# Altium schematic sheet TOP.SchDoc
size A3; SheetNumber: 1; SheetTotal: 3
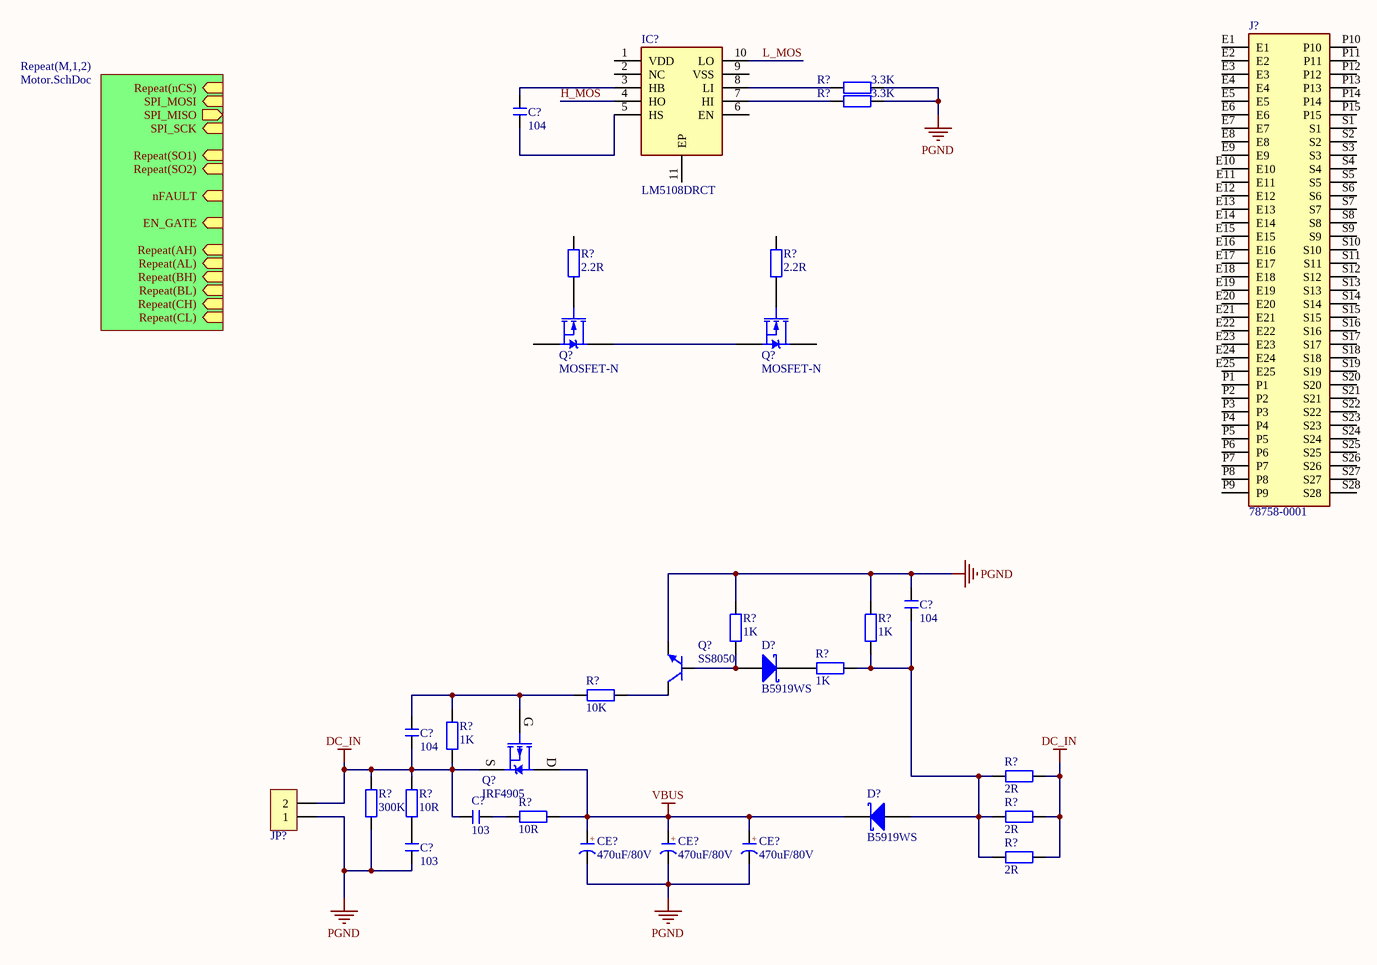
[diagram p0: TOP.SchDoc]

## Parts
(Parts that share a designator on the sheet are numbered #1, #2 ... from top to bottom, then left to right.)
C?#1  104  [C 0603_L]
C?#2  104  [C 0805_L]
C?#3  104  [C 0805_L]
C?#4  103  [C 0805_L]
C?#5  103  [C 0805_L]
CE?#1  470uF/80V  [CAP 1.5*4*8]
CE?#2  470uF/80V  [CAP 1.5*4*8]
CE?#3  470uF/80V  [CAP 1.5*4*8]
D?#1  B5919WS  [SOD-323]
D?#2  B5919WS  [SOD-323]
IC?  LM5108DRCT  [SON50P300X300X100-11N-D]
J?  78758-0001  [78758-0001]
JP?  HDR-1X2  [XH2.54-WI-2P]  (value not drawn)
Q?#1  MOSFET-N  [TO263-3B]
Q?#2  MOSFET-N  [TO263-3B]
Q?#3  SS8050  [SOT23-3N]
Q?#4  IRF4905  [TO220A]
R?#1  3.3K  [R 0603_L]
R?#2  3.3K  [R 0603_L]
R?#3  2.2R  [R 0603_L]
R?#4  2.2R  [R 0603_L]
R?#5  1K  [R 0805_L]
R?#6  1K  [R 0805_L]
R?#7  1K  [R 0805_L]
R?#8  10K  [R 0805_L]
R?#9  1K  [R 0805_L]
R?#10  300K  [R 0805_L]
R?#11  10R  [R 0805_L]
R?#12  2R  [RX10-18*15*5]
R?#13  10R  [R 0805_L]
R?#14  2R  [RX10-18*15*5]
R?#15  2R  [RX10-18*15*5]

## Sub-sheets
Repeat(M,1,2) = Motor.SchDoc: Repeat(nCS) (in), SPI_MOSI (in), SPI_MISO (out), SPI_SCK (in), Repeat(SO1) (in), Repeat(SO2) (in), nFAULT (in), Repeat(CH) (in), Repeat(CL) (in), Repeat(AH) (in), Repeat(AL) (in), Repeat(BH) (in), Repeat(BL) (in), EN_GATE (in)

## Nets
DC_IN: C?#3.1 C?#4.2 JP?.2 Q?#4.3(S) R?#9.1 R?#10.1 R?#11.1 R?#12.1 R?#14.1 R?#15.1
PGND: C?#2.1 C?#5.2 CE?#1.2(K) CE?#2.2(K) CE?#3.2(K) JP?.1 Q?#3.2(E) R?#1.2 R?#2.2 R?#5.1 R?#6.2 R?#10.2
VBUS: CE?#1.1(A) CE?#2.1(A) CE?#3.1(A) D?#2.2(K) Q?#4.2(D) R?#13.1
H_MOS: IC?.4(HO)
L_MOS: IC?.10(LO)
NetC?#1_1: C?#1.1 IC?.5(HS)
NetC?#1_2: C?#1.2 IC?.3(HB)
NetC?#2_2: C?#2.2 D?#2.1(A) R?#6.1 R?#7.2 R?#12.2 R?#14.2 R?#15.2
NetC?#3_2: C?#3.2 Q?#4.1(G) R?#8.1 R?#9.2
NetC?#4_1: C?#4.1 R?#13.2
NetC?#5_1: C?#5.1 R?#11.2
NetD?#1_1: D?#1.1(A) Q?#3.1(B) R?#5.2
NetD?#1_2: D?#1.2(K) R?#7.1
NetIC?_7: IC?.7(HI) R?#2.1
NetIC?_8: IC?.8(LI) R?#1.1
NetQ?#1_1: Q?#1.1(G) R?#3.2
NetQ?#1_2: Q?#1.2(D) Q?#2.3(S)
NetQ?#2_1: Q?#2.1(G) R?#4.2
NetQ?#3_3: Q?#3.3(C) R?#8.2

Not connected (* = marked no-connect by the designer): IC? 1(VDD) 2(NC) 6(EN) 9(VSS) 11(EP); J? E1 E2 E3 E4 E5 E6 E7 E8 E9 E10 E11 E12 E13 E14 E15 E16 E17 E18 E19 E20 E21 E22 E23 E24 E25 P1 P2 P3 P4 P5 P6 P7 P8 P9 P10 P11 P12 P13 P14 P15 S1 S2 S3 S4 S5 S6 S7 S8 S9 S10 S11 S12 S13 S14 S15 S16 S17 S18 S19 S20 S21 S22 S23 S24 S25 S26 S27 S28; Q?#1 3(S); Q?#2 2(D); R?#3 1; R?#4 1

## Notes on the sheet
- (in symbol CE) +

## Library data of the parts
C?#1-C?#5 = C: 贴片电容; BOM名称: 无极性贴片电容; 淘宝ID: 封装库来自淘宝 ID：黄晶宝石; 联系售后，技术支持: https://shop463601444.taobao.com; 唯一出售店铺网址: https://shop463601444.taobao.com
CE?#1-CE?#3 = CE: 直插电解电容; 淘宝ID: 封装库来自淘宝 ID：黄晶宝石; BOM名称: 直插电解电容; 联系售后: https://shop463601444.taobao.com
D?#1 D?#2 = 1N5819: 肖特基二极管; 淘宝ID: 封装库来自淘宝 ID：黄晶宝石; 属性: 40V/2A; BOM名称: 肖特基二极管; 欢迎光临: https://shop463601444.taobao.com
IC? = LM5108DRCT: Integrated Circuit; Manufacturer_Name: Texas Instruments; Datasheet Link: http://www.ti.com/lit/gpn/LM5108; Height: 1mm; Manufacturer_Part_Number: LM5108DRCT; Mouser Part Number: 595-LM5108DRCT; Mouser Price/Stock: https://www.mouser.co.uk/ProductDetail/Texas-Instruments/LM5108DRCT?qs=T3oQrply3y%2FzIxTRQrXrXQ%3D%3D; Arrow Part Number: LM5108DRCT; Arrow Price/Stock: https://www.arrow.com/en/products/lm5108drct/texas-instruments?region=nac
J? = 78758-0001: Connector; Manufacturer_Name: Molex; Manufacturer_Part_Number: 78758-0001; Mouser Part Number: 538-78758-0001; Mouser Price/Stock: https://www.mouser.co.uk/ProductDetail/Molex/78758-0001?qs=wOSGPAwRNAFEK7d2ROR5rw%3D%3D
JP? = Header 2: 2P接插件; 版权归属: 封装库来自淘宝 ID：黄晶宝石; BOM名称: 2P接插件; 联系售后: https://shop463601444.taobao.com
Q?#1 Q?#2 = MOSFET-N: N-Channel MOSFET; PackageDocument: 1995/1996; Published: 8-Jun-2000; LatestRevisionDate: 17-Jul-2002; LatestRevisionNote: Re-released for DXP Platform.; PackageReference: E3; Publisher: Altium Limited
Q?#3 = 8050-SMD: 高频放大-NPN型; 版权归属: 封装库来自淘宝 ID：黄晶宝石; 属性: 40V 1.5A 1W 100MHZ; BOM名称: 高频放大-NPN型; 联系售后: https://shop463601444.taobao.com
Q?#4 = IRF4905: P沟场效应管; 版权归属: 封装库来自淘宝卖家 ID：黄晶宝石; BOM名称: P沟场效应管; 技术支持，联系售后: https://shop463601444.taobao.com
R?#1-R?#11 R?#13 = R: 贴片电阻; 版权归属: 来自淘宝 ID：黄晶宝石; 封装库来自淘宝卖家 ID：黄晶宝石: 其他店铺购入均为盗版，不享受售后技术支持服务，请立即申请退款; BOM名称: 贴片电阻; 联系售后: https://shop463601444.taobao.com
R?#12 R?#14 R?#15 = R_MPR: 5W无感水泥电阻; BOM名称: 大功率电阻; 版权归属: 封装库来自淘宝 ID：黄晶宝石; 联系售后: https://shop463601444.taobao.com